# Altium schematic sheet Sheet1.SchDoc: Controlador de Aquecedor Industrial
size A4; Author: Mateus Eusébio; SheetNumber: 1; SheetTotal: 1
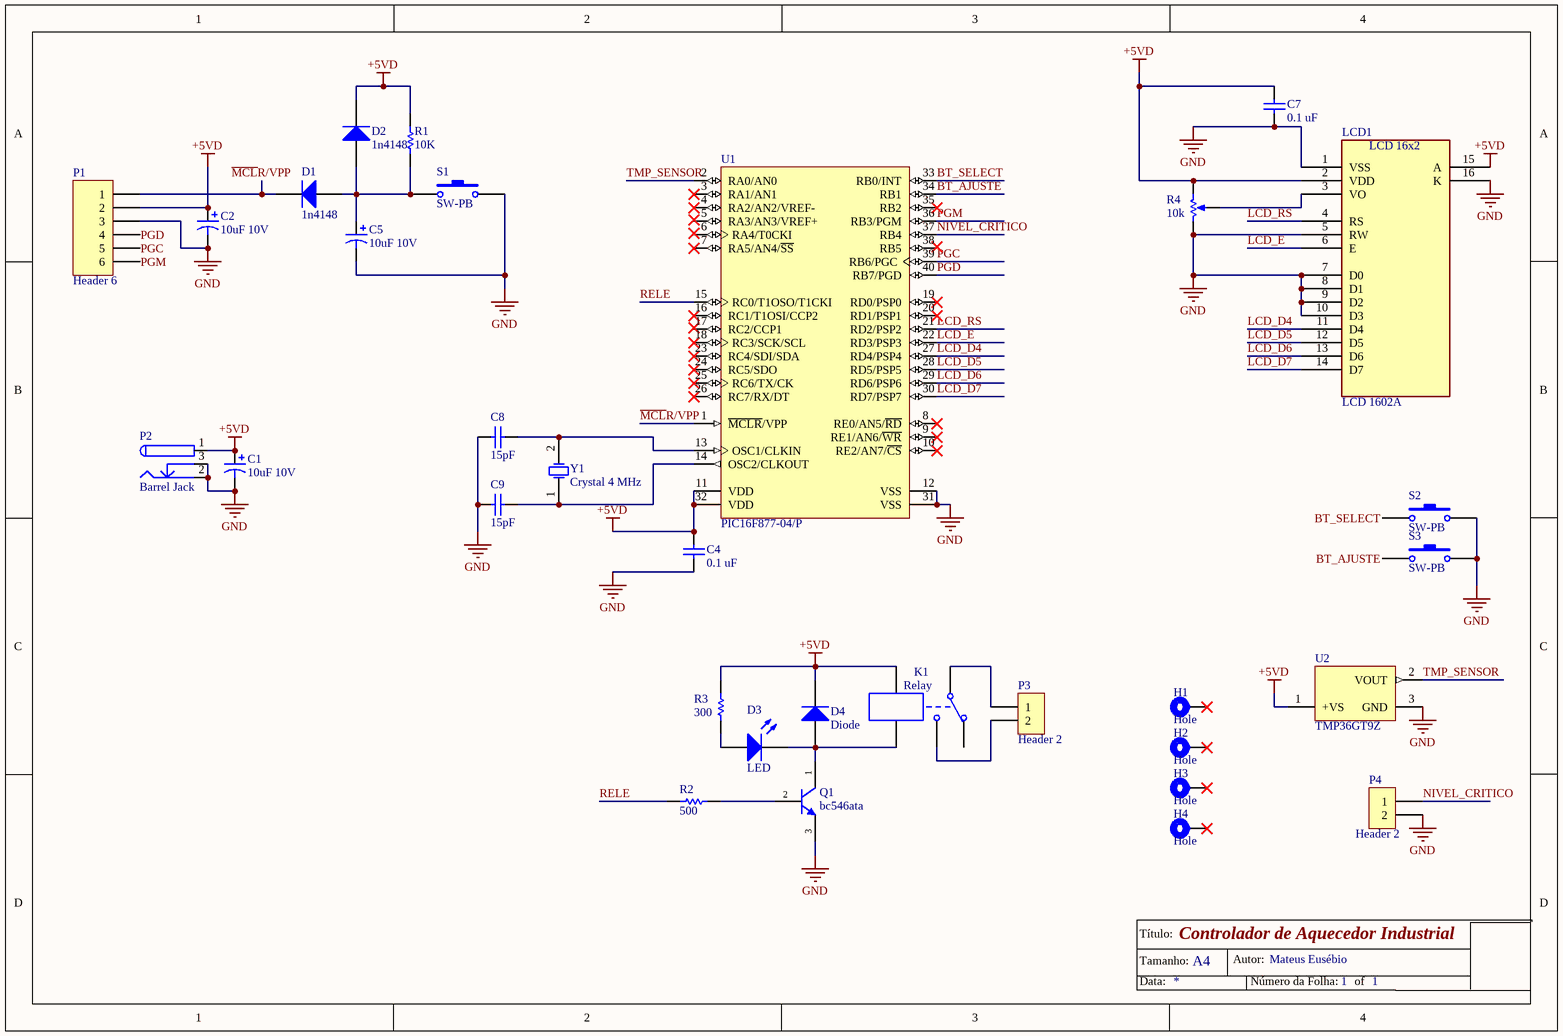
[diagram p0: Sheet1.SchDoc]

## Parts
C1  10uF 10V  [CAPPR5-6.3x11]
C2  10uF 10V  [CAPPR5-6.3x11]
C4  0.1 uF  [RAD-0.2]
C5  10uF 10V  [CAPPR5-6.3x11]
C7  0.1 uF  [RAD-0.2]
C8  15pF  [RAD-0.2]
C9  15pF  [RAD-0.2]
D1  1n4148  [DIODE-1N400X]
D2  1n4148  [DIODE-1N400X]
D3  LED  [LED_5MM_GREEN]
D4  Diode  [DIODE-1N400X]
H1  Hole  [HOLE_M3]
H2  Hole  [HOLE_M3]
H3  Hole  [HOLE_M3]
H4  Hole  [HOLE_M3]
K1  Relay  [RELAY_RTD14005]
LCD1  LCD 1602A  [LCD_RC1602B-BIW-CSV]
P1  Header 6  [HDR1X6m]
P2  Barrel Jack  [BARREL2.5]
P3  Header 2  [conector rele]
P4  Header 2  [conector rele]
Q1  bc546ata  [TO-92]
R1  10K  [AXIAL-0.4]
R2  500  [AXIAL-0.4]
R3  300  [AXIAL-0.4]
R4  10k  [VR1]
S1  SW-PB  [PB-SW]
S2  SW-PB  [PB-SW]
S3  SW-PB  [PB-SW]
U1  PIC16F877-04/P  [MCHP-PDIP-P40]
U2  TMP36GT9Z  [ADI-T-3]
Y1  Crystal 4 MHz  [CRYSTAL-HC49S]

## Nets
+5VD: C1.1 C2.1 C4.2 C7.2 D2.2(K) D4.2(K) K1.A1 LCD1.2(VDD) LCD1.15(A) P1.2 P2.1 R1.2 R3.1 R4.1(TOP) U1.11(VDD) U1.32(VDD) U2.1(+VS)
GND: C1.2 C2.2 C4.1 C5.2 C7.1 C8.1 C9.1 LCD1.1(VSS) LCD1.5(RW) LCD1.7(D0) LCD1.8(D1) LCD1.9(D2) LCD1.10(D3) LCD1.16(K) P1.3 P2.2 P2.3 P4.2 Q1.3(E) R4.2(BOT) S1.2 S2.2 S3.2 U1.12(VSS) U1.31(VSS) U2.3(GND)
~{MCL}R/VPP: D1.2(K) P1.1 U1.1(~{MCLR}/VPP)
BT_AJUSTE: S3.1 U1.34(RB1)
BT_SELECT: S2.1 U1.33(RB0/INT)
LCD_D4: LCD1.11(D4) U1.27(RD4/PSP4)
LCD_D5: LCD1.12(D5) U1.28(RD5/PSP5)
LCD_D6: LCD1.13(D6) U1.29(RD6/PSP6)
LCD_D7: LCD1.14(D7) U1.30(RD7/PSP7)
LCD_E: LCD1.6(E) U1.22(RD3/PSP3)
LCD_RS: LCD1.4(RS) U1.21(RD2/PSP2)
NIVEL_CRITICO: P4.1 U1.37(RB4)
PGC: P1.5 U1.39(RB6/PGC)
PGD: P1.4 U1.40(RB7/PGD)
PGM: P1.6 U1.36(RB3/PGM)
RELE: R2.2 U1.15(RC0/T1OSO/T1CKI)
TMP_SENSOR: U1.2(RA0/AN0) U2.2(VOUT)
NetC5_1: C5.1 D1.1(A) D2.1(A) R1.1 S1.1
NetC8_2: C8.2 U1.13(OSC1/CLKIN) Y1.2(OSC2)
NetC9_2: C9.2 U1.14(OSC2/CLKOUT) Y1.1(OSC1)
NetD3_1: D3.1(A) R3.2
NetD3_2: D3.2(K) D4.1(A) K1.A2 Q1.1(C)
NetK1_1: K1.1 P3.1
NetK1_4: K1.4 P3.2
NetLCD1_3: LCD1.3(VO) R4.3(TAP)
NetQ1_2: Q1.2(B) R2.1

Not connected (* = marked no-connect by the designer): H1 1*; H2 1*; H3 1*; H4 1*; K1 2; U1 3(RA1/AN1)* 4(RA2/AN2/VREF-)* 5(RA3/AN3/VREF+) 6(RA4/T0CKI) 7(RA5/AN4/~{SS})* 8(RE0/AN5/~{RD})* 9(RE1/AN6/~{WR})* 10(RE2/AN7/~{CS})* 16(RC1/T1OSI/CCP2)* 17(RC2/CCP1) 18(RC3/SCK/SCL)* 19(RD0/PSP0)* 20(RD1/PSP1)* 23(RC4/SDI/SDA)* 24(RC5/SDO)* 25(RC6/TX/CK)* 26(RC7/RX/DT)* 35(RB2)* 38(RB5)

## Notes on the sheet
- Título:
- Tamanho:
- Data:
- A4
- Autor:
- Número da Folha:
- of
- (in symbol LCD 1602A) LCD 16x2

## Library data of the parts
C1 C2 C5 = CP: Radial-ECAP; Manufacturer Part Number: 10MS510MEFC4X5; Tolerance: 20%; Ripple Current: 16mA; Life (Hours): 1000Hour; Manufacturer: *; PartNumber: *; Package Type: *; Value: *; Supplier 1: Digi-Key; Supplier Part Number 1: 1189-4041-ND; RoHS: Yes; Category: Aluminum Electrolytic Capacitors; Stock 1: 926; Pricing 1: 1=0,26000, 10=0,17700, 50=0,11780, 100=0,10010, 500=0,07066, 1000=0,06182, 2500=0,05888, 5000=0,05446 (USD); Mount: Through Hole; Case/Package: Radial; Min Operating Temperature: -40°C; Max Operating Temperature: 85°C; Package Quantity: 5000; Packaging: Bulk; Voltage Rating: 10V; Voltage Rating (DC): 10V; Capacitance: 10uF; Series: MS5; Diameter: 4mm; Height: 5mm; Lead Pitch: 0.059inch; Height - Seated (Max): 0.256inch; RoHS Compliant: Yes; ComponentLink1URL: https://datasheet.ciiva.com/6318/e-ms5-6318997.pdf?src-supplier=Digi-Key; ComponentLink1Description: https://datasheet.ciiva.com/6318/e-ms5-6318997.pdf?src-supplier=Digi-Key
C4 C7 = C: CAP CER 100PF 100V C0G/NP0 RAD; Manufacturer Part Number: RCE5C2A101J0M1H03A; Value: 1; Tolerance: 5%; Dielectric: C0G; Lead/Base Style: Formed Leads; Lead Diameter: 0.5mm; Manufacturer: *; PartNumber: *; Package Type: *; Supplier 1: Digi-Key; Supplier Part Number 1: 490-7421-1-ND; RoHS: Yes; Category: Ceramic Capacitors; Stock 1: 2206; Pricing 1: 1=0,53000, 10=0,37300, 50=0,28200, 100=0,24560, 500=0,18194, 1000=0,15465 (USD); Mount: Through Hole; Case/Package: Radial; Min Operating Temperature: -55°C; Max Operating Temperature: 125°C; Package Quantity: 2000; Packaging: Tape and Reel; Capacitance: 100pF; Voltage Rating: 100V; Voltage Rating (DC): 100V; Termination: Radial; Resistor Type: Ceramic; Length: 0.142inch; Width: 0.098inch; Height: 3.5mm; Height - Seated (Max): 0.138inch; Lead Pitch: 0.197inch; Ratings: AEC-Q200; RoHS Compliant: Yes; ComponentLink1URL: https://datasheet.ciiva.com/18699/cnrpee-18699766.pdf?src-supplier=Digi-Key; ComponentLink1Description: https://datasheet.ciiva.com/18699/cnrpee-18699766.pdf?src-supplier=Digi-Key; ComponentLink2URL: https://datasheet.ciiva.com/18699/cnrpee-18699767.pdf?src-supplier=Digi-Key; ComponentLink2Description: https://datasheet.ciiva.com/18699/cnrpee-18699767.pdf?src-supplier=Digi-Key
C8 C9 = C: Ceramic Capacitor, Multilayer, Ceramic, 50V, 5% +Tol, 5% -Tol, C0G, 30ppm/Cel TC, 0.000015uF, Through Hole Mount; Manufacturer Part Number: K150J15C0GF5TL2; Value: 1; Lead/Base Style: Straight; Lead Length: 30mm; Manufacturer: *; PartNumber: *; Package Type: *; Supplier 1: Digi-Key; Supplier Part Number 1: BC1003CT-ND; RoHS: Yes; Category: Ceramic Capacitors; Stock 1: 7836; Pricing 1: 1=0,26000, 10=0,17500, 50=0,10500, 100=0,08860, 500=0,06064, 1000=0,05364 (USD); Mount: Through Hole; Case/Package: Dipped; Number of Pins: 2; Dielectric Material: Ceramic; Min Operating Temperature: -55°C; Max Operating Temperature: 125°C; Capacitance: 15pF; Tolerance: 5%; Voltage Rating: 50V; Packaging: Tape and Reel; Package Quantity: 4000; Dielectric: C0G; Termination: Radial; Voltage Rating (DC): 50V; Series: Mono-Kap™ K; Construction: RADIAL; Length: 0.157inch; Width: 0.098inch; Lead Pitch: 2.5mm; Height - Seated (Max): 0.22inch; Depth: 2.6mm; Radiation Hardening: No; REACH SVHC: Unknown; Lead Free: Lead Free; RoHS Compliant: Yes; ComponentLink1URL: https://datasheet.ciiva.com/145/kseries-145757.pdf?src-supplier=Digi-Key; ComponentLink1Description: https://datasheet.ciiva.com/145/kseries-145757.pdf?src-supplier=Digi-Key; ComponentLink2URL: https://datasheet.ciiva.com/145/kseries-145756.pdf?src-supplier=Digi-Key; ComponentLink2Description: https://datasheet.ciiva.com/145/kseries-145756.pdf?src-supplier=Digi-Key; ComponentLink3URL: https://datasheet.ciiva.com/46394/1756139-46394535.pdf?src-supplier=Element14; ComponentLink3Description: https://datasheet.ciiva.com/46394/1756139-46394535.pdf?src-supplier=Element14; ComponentLink4URL: https://datasheet.ciiva.com/16458/kseries-16458760.pdf?src-supplier=Future+Electronics; ComponentLink4Description: https://datasheet.ciiva.com/16458/kseries-16458760.pdf?src-supplier=Future+Electronics; ComponentLink5URL: https://datasheet.ciiva.com/7974/1682830-7974813.pdf?src-supplier=Element14; ComponentLink5Description: https://datasheet.ciiva.com/7974/1682830-7974813.pdf?src-supplier=Element14
D1 D2 = D: Diode; Manufacturer: *; PartNumber: *; Package Type: *
D4 = D: Manufacturer: *; PartNumber: *; Package Type: *
K1 = Relay: Single-Pole Dual-Throw Relay; Package Type: *; PartNumber: *; Manufacturer: *
LCD1 = LCD 1602A: Display: LCD; alphanumeric; STN Negative; 16x2; blue; LED; PIN: 16; MP: RC1602B-BIW-CSV; MF: Raystar; Price: None; Package: None; Value: *; Availability: Unavailable; SnapEDA_Link: https://www.snapeda.com/parts/RC1602B-BIW-CSV/Raystar/view-part/581171/?ref=snap
P1 = Header 6: Header, 6-Pin; LatestRevisionDate: 17-Jul-2002; LatestRevisionNote: Re-released for DXP Platform.; Publisher: Altium Limited
P2 = PWR2.5: Low Voltage Power Supply Connector; Manufacturer: Memory Protection Devices; Manufacturer Part Number: EJ503A; Pricing 1: 1=2.7, 10=2.447, 100=2.0977, 500=1.74806, 1000=1.49834 (USD); Stock 1: 1084; Supplier 1: Digi-Key; Supplier Part Number 1: EJ503A-ND
Q1 = NPN: Trans GP BJT NPN 65V 0.1A 3-Pin TO-92 Ammo; Max Power Dissipation: 500mW; Max Collector Current: 100mA; Transition Frequency: 300MHz; Number of Elements: 1; Collector Base Voltage (VCBO): 80V; Emitter Base Voltage (VEBO): 6V; Element Configuration: Single; Collector-emitter Voltage-Max: 600mV; hFE Min: 110; Collector Emitter Saturation Voltage: 250mV; Manufacturer: *; PartNumber: *; Package Type: *; Supplier 1: Digi-Key; Supplier Part Number 1: BC546ATAFSCT-ND; Manufacturer Part Number: BC546ATA; RoHS: Yes; Category: BJTs; Pricing 1: 1=0,30000, 10=0,25000, 25=0,20880, 100=0,13230, 500=0,08706, 1000=0,05920 (USD); Mount: Through Hole; Case/Package: TO-92-3; Number of Pins: 3; Contact Plating: Tin,Matte; Weight: 0.24g; Min Operating Temperature: -65°C; Max Operating Temperature: 150°C; Package Quantity: 2000; Collector Emitter Voltage (VCEO): 65V; Packaging: Ammo Pack; Collector Emitter Breakdown Voltage: 65V; Frequency: 300MHz; Polarity: NPN; Power Dissipation: 500mW; Gain Bandwidth Product: 300MHz; Max Breakdown Voltage: 65V; Series: -; Max Frequency: 300MHz; Voltage Rating (DC): 65V; Current Rating: 100mA; Length: 4.58mm; Width: 3.86mm; Height: 4.58mm; Lead Free: Lead Free; REACH SVHC: No SVHC; ComponentLink1URL: https://datasheet.ciiva.com/11205/bc550-11205919.pdf?src-supplier=Avnet; ComponentLink1Description: https://datasheet.ciiva.com/11205/bc550-11205919.pdf?src-supplier=Avnet; ComponentLink2URL: https://datasheet.ciiva.com/4722/bc546-4722077.pdf?src-supplier=Mouser; ComponentLink2Description: https://datasheet.ciiva.com/4722/bc546-4722077.pdf?src-supplier=Mouser; ComponentLink3URL: https://datasheet.ciiva.com/46415/1868820-46415432.pdf?src-supplier=Element14; ComponentLink3Description: https://datasheet.ciiva.com/46415/1868820-46415432.pdf?src-supplier=Element14; ComponentLink4URL: https://datasheet.ciiva.com/25996/bc550-25996601.pdf?src-supplier=Avnet+Europe; ComponentLink4Description: https://datasheet.ciiva.com/25996/bc550-25996601.pdf?src-supplier=Avnet+Europe
R1-R3 = R: Res Carbon Film 10K Ohm 5% 1/6W -500ppm/°C to 350ppm/°C Conformal AXL Thru-Hole Ammo Pack; Manufacturer Part Number: CFR-12JT-52-10K; Value: 0; Resistance: 10kR; Power Rating: 167mW; Manufacturer: *; PartNumber: *; Package Type: *; Supplier 1: Digi-Key; Supplier Part Number 1: 13-CFR-12JT-52-10KCT-ND; Category: Through-Hole Resistors; Pricing 1: 1=0,10000, 10=0,07400, 25=0,05120, 50=0,03980, 100=0,02840, 250=0,02216, 500=0,01760, 1000=0,01250 (USD); Mount: Through Hole; Case/Package: Conformal; Contact Plating: Tin; Min Operating Temperature: -55°C; Max Operating Temperature: 155°C; Tolerance: 5%; Resistor Type: Carbon Film; Temperature Coefficient: 350ppm/°C; Termination: Axial; Construction: Cylindrical; Diameter: 1.9mm; Length: 3.4mm; Radiation Hardening: No; Military Standard: Not; Lead Free: Lead Free; RoHS Compliant: Yes; ComponentLink1URL: http://components.arrow.com/part/dataview/0323_03325961?src-supplier=Arrow+Europe; ComponentLink1Description: http://components.arrow.com/part/dataview/0323_03325961?src-supplier=Arrow+Europe; ComponentLink2URL: http://www.yageo.com/documents/recent/Yageo%20LR_CFR_2013.pdf?src-supplier=Avnet; ComponentLink2Description: http://www.yageo.com/documents/recent/Yageo%20LR_CFR_2013.pdf?src-supplier=Avnet; ComponentLink3URL: http://www.yageo.com/documents/recent/Leaded-R_CFR_2011.pdf?src-supplier=Avnet+Europe; ComponentLink3Description: http://www.yageo.com/documents/recent/Leaded-R_CFR_2011.pdf?src-supplier=Avnet+Europe; ComponentLink4URL: http://www.yageo.com/documents/recent/General%20Type_CFR.pdf?src-supplier=Future+Electronics; ComponentLink4Description: http://www.yageo.com/documents/recent/General%20Type_CFR.pdf?src-supplier=Future+Electronics; ComponentLink5URL: http://datasheet.octopart.com/CFR-12JT52-10K-Yageo-datasheet-12509909.pdf?src-supplier=_legacy+Avnet; ComponentLink5Description: http://datasheet.octopart.com/CFR-12JT52-10K-Yageo-datasheet-12509909.pdf?src-supplier=_legacy+Avnet; ComponentLink6URL: http://datasheet.octopart.com/CFR-12JT52-10K-Yageo-datasheet-28066625.pdf?src-supplier=Megastar; ComponentLink6Description: http://datasheet.octopart.com/CFR-12JT52-10K-Yageo-datasheet-28066625.pdf?src-supplier=Megastar; ComponentLink7URL: http://datasheet.octopart.com/CFR-12JT52-10K-Yageo-datasheet-118566.pdf?src-supplier=Future+Electronics; ComponentLink7Description: http://datasheet.octopart.com/CFR-12JT52-10K-Yageo-datasheet-118566.pdf?src-supplier=Future+Electronics; ComponentLink8URL: http://datasheet.octopart.com/CFR-12JT52-10K-Yageo-datasheet-17276704.pdf?src-supplier=Future+Electronics; ComponentLink8Description: http://datasheet.octopart.com/CFR-12JT52-10K-Yageo-datasheet-17276704.pdf?src-supplier=Future+Electronics; ComponentLink9URL: http://datasheet.octopart.com/CFR-12JT52-10K-Yageo-datasheet-137875058.pdf?src-supplier=Future+Electronics; ComponentLink9Description: http://datasheet.octopart.com/CFR-12JT52-10K-Yageo-datasheet-137875058.pdf?src-supplier=Future+Electronics
R4 = R Pot: TRIMMER 10K OHM 0.5W PC PIN; Manufacturer Part Number: 3296W-1-103ALF; Tolerance: 10%; Resistance: 10kR; Power Rating: 500mW; Number of Turns: 25; Temperature Coefficient: 100ppm/°C; Manufacturer: *; PartNumber: *; Package Type: *; Value: *; Set Position: *; Supplier 1: Digi-Key; Supplier Part Number 1: 3296W-1-103ALF-ND; RoHS: Yes; Category: Variable Resistors and Potentiometers; Pricing 1: 1000=1,81350 (USD); Mount: Through Hole,PCB; Weight: 0.03oz; Contact Plating: Tin,Matte; Min Operating Temperature: -55°C; Max Operating Temperature: 125°C; Package Quantity: 1000; Packaging: Ammo Pack; Resistor Type: Cermet; Termination: Pin; Taper: Linear; Max Power Dissipation: 500mW; Type: Potentiometer; Series: Trimpot® 3296 - Sealed; Technology: CERMET; Length: 9.53mm; Width: 0.19inch; Height: 0.395inch; Depth: 4.83mm; Military Standard: Not; RoHS Compliant: Yes; ComponentLink1URL: https://datasheet.ciiva.com/2162/3296-2162754.pdf?src-supplier=Digi-Key; ComponentLink1Description: https://datasheet.ciiva.com/2162/3296-2162754.pdf?src-supplier=Digi-Key
S1-S3 = SW Tact: Tactile Switches 6mm square tact; Manufacturer Part Number: MJTP1230A; Mechanical Life: 100000Cycles; Actuator Material: Thermoplastic; Actuator Color: Black; Operating Force: 160gf; Current Rating: 50mA; Voltage Rating (DC): 12V; Throw Configuration: SPST; Contact Resistance: 100mR; Illumination Type: Non-Illuminated,Illuminated; Switch Travel: 0.25mm; Switch Function: Off-Mom; Actuator Type: Standard; Actuator Length: 1.4mm; Manufacturer: *; PartNumber: *; Package Type: *; Supplier 1: Digi-Key; Supplier Part Number 1: 679-2429-ND; RoHS: Yes; Category: Tactile Switches; Stock 1: 19622; Pricing 1: 1=0,22000, 10=0,20800, 25=0,19720, 100=0,17860, 250=0,16280, 500=0,15130, 1000=0,12908, 2500=0,12549, 5000=0,11832 (USD); Mount: Through Hole; Color: Black; Contact Plating: Silver; Contact Material: Bronze,Stainless Steel; Min Operating Temperature: -20°C; Max Operating Temperature: 70°C; Package Quantity: 100; Packaging: Bulk; Max Voltage Rating (DC): 12V; Termination: PC Pin; Electrical Life: 100000Cycles; Orientation: Straight; Series: MJTP; REACH SVHC: No SVHC; RoHS Compliant: Yes; ComponentLink1URL: https://datasheet.ciiva.com/16155/mjtp-6mm-16155870.pdf?src-supplier=Onlinecomponents.com; ComponentLink1Description: https://datasheet.ciiva.com/16155/mjtp-6mm-16155870.pdf?src-supplier=Onlinecomponents.com
U1 = PIC16F877-04/P: 8-bit Microcontrollers - MCU 14KB 368 RAM 33 I/O; Manufacturer: Microchip; Manufacturer Part Number: PIC16F877A-I/P; # of A/D Channels: 8; Digital Communication: 0 -UART, 1 -A/E/USART, 0 -SPI, 0 -I2C, 1 -MSSP(SPI/I2C); EEPROM Data Memory (bytes): 256; Max. CPU Speed MHz: 4; Memory Type: Flash; Operation Voltage Range: 2V - 5.5V; Packing: TUBE; Program Memory KBytes: 14; RAM: 368; Timers: 2 - 8-bit, 1 - 16-bit; Interface: I2C,SPI,UART,USART,SSP; RAM Size: 368B; Number of Timers/Counters: 3; Number of Programmable I/O: 33; Data Bus Width: 8b; Max Frequency: 20MHz; Core Architecture: PIC; Min Supply Voltage: 4V; Max Supply Voltage: 5.5V; Watchdog Timer: Yes; Access Time: 20us; Number of PWM Channels: 2; Number of SPI Channels: 1; Oscillator Type: External; Nominal Supply Current: 1.6mA; Peripherals: Brown-out Detect/Reset,POR,PWM,WDT,I2C; DatasheetVersion: Rev. D; PackageVersion: C04-016B, 04/2013; PackageReference: PDIP-P40; PackageDescription: 40-Lead Plastic Dual In-Line Package, Body 51.75 x 13.53 mm, Pitch 2.54 mm; Supplier 1: Digi-Key; Supplier Part Number 1: PIC16F877-04/P-ND; Supplier 2: Farnell; Supplier Part Number 2: 1523963; Supplier 3: Farnell; Supplier Part Number 3: 9761349; Supplier 4: Newark; Supplier Part Number 4: 61K3463; Supplier 5: Mouser; Supplier Part Number 5: 579-PIC16F87704P; Program Memory KWords: 8; RoHS: TRUE; Mounting Technology: Through Hole; PartNumber: PIC16F877-04/P; ComponentLink1Description: Datasheet; ComponentLink1URL: http://ww1.microchip.com/downloads/en/DeviceDoc/30292D.pdf; ComponentLink2Description: Package Specification; ComponentLink2URL: http://www.microchip.com/stellent/groups/techpub_sg/documents/packagingspec/en012702.pdf; ComponentLink3Description: URL Link1; ComponentLink3URL: Product URL:http://www.microchip.com/datasheet/PIC16F877; Supplier 6: Digi-Key; Supplier Part Number 6: PIC16F877A-I/P-ND; Category: Microcontrollers; Stock 6: 1089; Pricing 6: 1=6,60000 (USD); Mount: Through Hole; Case/Package: PDIP; Number of Pins: 40; Min Operating Temperature: -40°C; Max Operating Temperature: 85°C; Memory Size: 14KB; Frequency: 20MHz; Packaging: Rail/Tube; Density: 14KB; Number of ADC Channels: 8; Number of I/Os: 33; Package Quantity: 10; Number of I2C Channels: 1; Number of Bits: 8; Address Bus Width: 8b; Supply Current: 1.6mA; Length: 52.45mm; Width: 14.22mm; Height: 4.06mm; Radiation Hardening: No; Lead Free: Lead Free; REACH SVHC: No SVHC; ComponentLink4URL: https://datasheet.ciiva.com/20167/73-3352-20167940.pdf?src-supplier=Rapid+Electronics; ComponentLink4Description: https://datasheet.ciiva.com/20167/73-3352-20167940.pdf?src-supplier=Rapid+Electronics; ComponentLink5URL: https://datasheet.ciiva.com/26815/pic16f877a-i-p-26815829.pdf?src-supplier=IIIC; ComponentLink5Description: https://datasheet.ciiva.com/26815/pic16f877a-i-p-26815829.pdf?src-supplier=IIIC; ComponentLink6URL: https://datasheet.ciiva.com/3203/39582b-3203499.pdf?src-supplier=Avnet; ComponentLink6Description: https://datasheet.ciiva.com/3203/39582b-3203499.pdf?src-supplier=Avnet; ComponentLink7URL: https://datasheet.ciiva.com/7774/1693496-7774278.pdf?src-supplier=Element14; ComponentLink7Description: https://datasheet.ciiva.com/7774/1693496-7774278.pdf?src-supplier=Element14; ComponentLink8URL: https://datasheet.ciiva.com/7774/39582b-7774279.pdf?src-supplier=Element14; ComponentLink8Description: https://datasheet.ciiva.com/7774/39582b-7774279.pdf?src-supplier=Element14; ComponentLink9URL: https://datasheet.ciiva.com/16478/filehandler-aspxddocname-en011789-16478671.pdf?src-supplier=Future+Electronics; ComponentLink9Description: https://datasheet.ciiva.com/16478/filehandler-aspxddocname-en011789-16478671.pdf?src-supplier=Future+Electronics; ComponentLink10URL: https://datasheet.ciiva.com/17383/39582b-17383214.pdf?src-supplier=Avnet+Europe; ComponentLink10Description: https://datasheet.ciiva.com/17383/39582b-17383214.pdf?src-supplier=Avnet+Europe; ComponentLink11URL: https://datasheet.ciiva.com/14131/capic16f87x-e-14131995.pdf?src-supplier=Distrelec; ComponentLink11Description: https://datasheet.ciiva.com/14131/capic16f87x-e-14131995.pdf?src-supplier=Distrelec; ComponentLink12URL: https://datasheet.ciiva.com/18404/70045630-18404427.pdf?src-supplier=Allied+Electronics; ComponentLink12Description: https://datasheet.ciiva.com/18404/70045630-18404427.pdf?src-supplier=Allied+Electronics; ComponentLink13URL: https://datasheet.ciiva.com/29331/165144-da-01-de-pic16f877a-i-p-29331836.pdf?src-supplier=Conrad; ComponentLink13Description: https://datasheet.ciiva.com/29331/165144-da-01-de-pic16f877a-i-p-29331836.pdf?src-supplier=Conrad
U2 = TMP36GT9Z: Low Voltage Temperature Sensor, 2.7 to 5.5 V Supply, Industrial, 3-pin TO92 (T-3), Tray; Manufacturer: Analog Devices; DatasheetVersion: Rev. F; PackageVersion: 042208-A, 04/2008; PackageReference: T-3; PackageDescription: 3-Pin Plastic Header-Style Package, 1.27 mm Pitch; Supplier 1: Digi-Key; Supplier Part Number 1: TMP36GT9Z-ND; Supplier 2: Farnell; Supplier Part Number 2: 1438760; Supplier 3: Newark; Supplier Part Number 3: 19M9015; Supplier 4: Mouser; Supplier Part Number 4: 584-TMP36GT9Z; Packing: Tray; Supply Voltage Range: 2.7 to 5.5 V; Mounting Technology: Through Hole; Code_JEDEC: TO-226-AA; PartNumber: TMP36GT9Z; ComponentLink1Description: Manufacturer URL; ComponentLink1URL: http://www.analog.com/en/index.html; ComponentLink2Description: Datasheet; ComponentLink2URL: http://www.analog.com/static/imported-files/data_sheets/TMP35_36_37.pdf; ComponentLink3Description: Package Specification; ComponentLink3URL: http://www.analog.com/static/imported-files/packages/PKG_PDF/TO-92(T)/T_3.pdf; ComponentLink4Description: Product URL; ComponentLink4URL: http://www.analog.com/en/mems-sensors/digital-temperature-sensors/tmp36/products/product.html
Y1 = XTAL: Crystal Oscillator; Manufacturer Part Number: HC49US-FF3F18-4.000MHZ; Manufacturer: *; PartNumber: *; Package Type: *; Supplier 1: Digi-Key; Supplier Part Number 1: 2780-HC49US-FF3F18-4.000MHZ-ND; RoHS: No; Stock 1: 930; Pricing 1: 1=0,33000, 10=0,27500, 50=0,24760, 100=0,22000, 500=0,20900, 1000=0,17600, 2500=0,16500, 5000=0,15950, 10000=0,15400 (USD)
D3 = LED: Manufacturer: *; PartNumber: *; Package Type: *